# Altium schematic sheet Sch2ByteChannel.SchDoc: Byte channel Control (BCC)
size A4; Address1: Afshin Kashani Ilkhechi; DocumentNumber: 2; Revision: 2; SheetNumber: 2; SheetTotal: 5
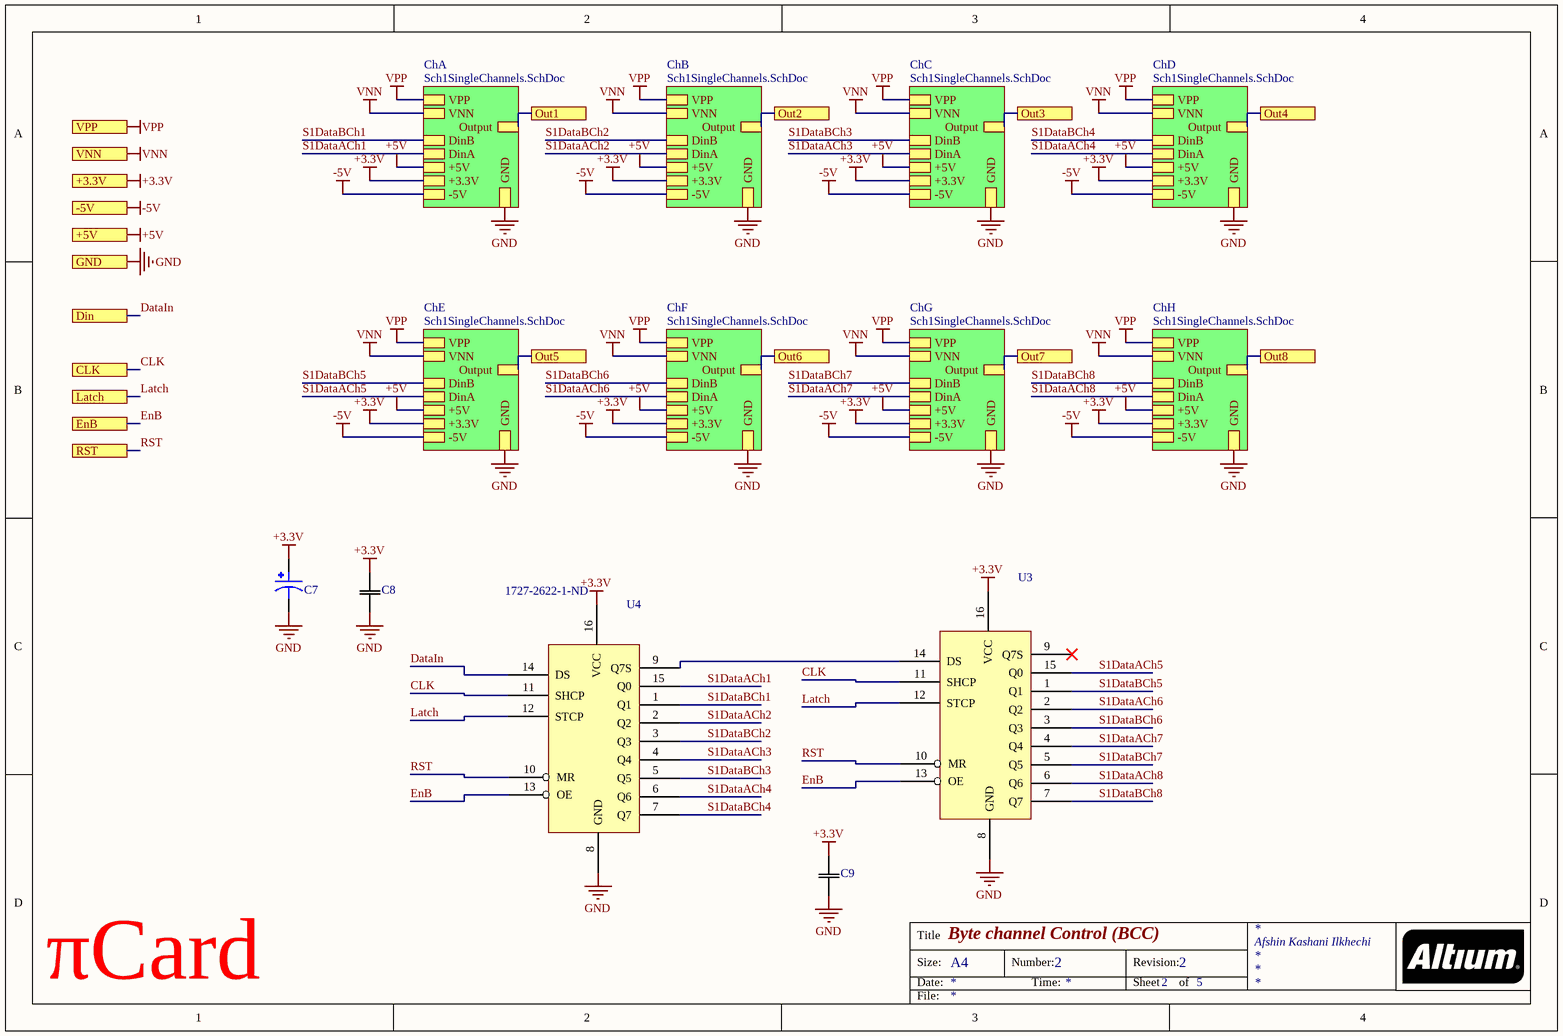
[diagram p0: Sch2ByteChannel.SchDoc]

## Parts
C7  T55A107M6R3C0200  [C1206]  (value not drawn)
C8  C0805C104Z5VACTU  [C0805]  (value not drawn)
C9  C0805C104Z5VACTU  [C0805]  (value not drawn)
U3  74HC595BQ-Q100,115  [QFN50P250X350X100-17N]  (value not drawn)
U4  Supplier Part Number 1: 1727-2622-1-ND  [QFN50P250X350X100-17N]  (hidden comment: 74HC595BQ-Q100,115)

## Sub-sheets
ChA = Sch1SingleChannels.SchDoc: GND, +5V, -5V, DinA, DinB, VPP, VNN, Output, +3.3V
ChB = Sch1SingleChannels.SchDoc: GND, +5V, -5V, DinA, DinB, VPP, VNN, Output, +3.3V
ChC = Sch1SingleChannels.SchDoc: GND, +5V, -5V, DinA, DinB, VPP, VNN, Output, +3.3V
ChD = Sch1SingleChannels.SchDoc: GND, +5V, -5V, DinA, DinB, VPP, VNN, Output, +3.3V
ChE = Sch1SingleChannels.SchDoc: GND, +5V, -5V, DinA, DinB, VPP, VNN, Output, +3.3V
ChF = Sch1SingleChannels.SchDoc: GND, +5V, -5V, DinA, DinB, VPP, VNN, Output, +3.3V
ChG = Sch1SingleChannels.SchDoc: GND, +5V, -5V, DinA, DinB, VPP, VNN, Output, +3.3V
ChH = Sch1SingleChannels.SchDoc: GND, +5V, -5V, DinA, DinB, VPP, VNN, Output, +3.3V

## Ports
+3.3V, +5V, -5V, CLK, Din, EnB, GND, Latch, Out1, Out2, Out3, Out4, Out5, Out6, Out7, Out8, RST, VNN, VPP

## Nets
+3.3V: C7.1(POS) C8.2 C9.2 U3.16(VCC) U4.16(VCC) ; port +3.3V, sheet ChA/+3.3V, sheet ChB/+3.3V, sheet ChC/+3.3V, sheet ChD/+3.3V, sheet ChE/+3.3V, sheet ChF/+3.3V, sheet ChG/+3.3V, sheet ChH/+3.3V
+5V: port +5V, sheet ChA/+5V, sheet ChB/+5V, sheet ChC/+5V, sheet ChD/+5V, sheet ChE/+5V, sheet ChF/+5V, sheet ChG/+5V, sheet ChH/+5V
-5V: port -5V, sheet ChA/-5V, sheet ChB/-5V, sheet ChC/-5V, sheet ChD/-5V, sheet ChE/-5V, sheet ChF/-5V, sheet ChG/-5V, sheet ChH/-5V
GND: C7.2(NEG) C8.1 C9.1 U3.8(GND) U4.8(GND) ; port GND, sheet ChA/GND, sheet ChB/GND, sheet ChC/GND, sheet ChD/GND, sheet ChE/GND, sheet ChF/GND, sheet ChG/GND, sheet ChH/GND
VNN: port VNN, sheet ChA/VNN, sheet ChB/VNN, sheet ChC/VNN, sheet ChD/VNN, sheet ChE/VNN, sheet ChF/VNN, sheet ChG/VNN, sheet ChH/VNN
VPP: port VPP, sheet ChA/VPP, sheet ChB/VPP, sheet ChC/VPP, sheet ChD/VPP, sheet ChE/VPP, sheet ChF/VPP, sheet ChG/VPP, sheet ChH/VPP
CLK: U3.11(SHCP) U4.11(SHCP) ; port CLK
DataIn: U4.14(DS) ; port Din
EnB: U3.13(OE) U4.13(OE) ; port EnB
Latch: U3.12(STCP) U4.12(STCP) ; port Latch
Out1: port Out1, sheet ChA/Output
Out2: port Out2, sheet ChB/Output
Out3: port Out3, sheet ChC/Output
Out4: port Out4, sheet ChD/Output
Out5: port Out5, sheet ChE/Output
Out6: port Out6, sheet ChF/Output
Out7: port Out7, sheet ChG/Output
Out8: port Out8, sheet ChH/Output
RST: U3.10(MR) U4.10(MR) ; port RST
S1DataACh1: U4.15(Q0) ; sheet ChA/DinA
S1DataACh2: U4.2(Q2) ; sheet ChB/DinA
S1DataACh3: U4.4(Q4) ; sheet ChC/DinA
S1DataACh4: U4.6(Q6) ; sheet ChD/DinA
S1DataACh5: U3.15(Q0) ; sheet ChE/DinA
S1DataACh6: U3.2(Q2) ; sheet ChF/DinA
S1DataACh7: U3.4(Q4) ; sheet ChG/DinA
S1DataACh8: U3.6(Q6) ; sheet ChH/DinA
S1DataBCh1: U4.1(Q1) ; sheet ChA/DinB
S1DataBCh2: U4.3(Q3) ; sheet ChB/DinB
S1DataBCh3: U4.5(Q5) ; sheet ChC/DinB
S1DataBCh4: U4.7(Q7) ; sheet ChD/DinB
S1DataBCh5: U3.1(Q1) ; sheet ChE/DinB
S1DataBCh6: U3.3(Q3) ; sheet ChF/DinB
S1DataBCh7: U3.5(Q5) ; sheet ChG/DinB
S1DataBCh8: U3.7(Q7) ; sheet ChH/DinB
NetU3_14: U3.14(DS) U4.9(Q7S)

Not connected (* = marked no-connect by the designer): U3 9(Q7S)*

## Notes on the sheet
- πCard
- Title
- Size:
- Date:
- A4
- Number:
- Time:
- Revision:
- Sheet
- of
- File:

## Library data of the parts
C7 = Cap_1206: Tantalium; Supplier 1: Mouser; Supplier Part Number 1: 74-T55A107M6R3C0200
C8 C9 = Cap_0805: Supplier 1: Digi-Key; Supplier Part Number 1: 399-1177-1-ND
U3 U4 = 74HC595BQ-Q100,115: Supplier 1: Digi-Key
  U3: Supplier Part Number 1: 1727-2622-1-ND